# EAGLE design RS485 Ethernet Gateway v1.0 (EAGLE 9.2.1)
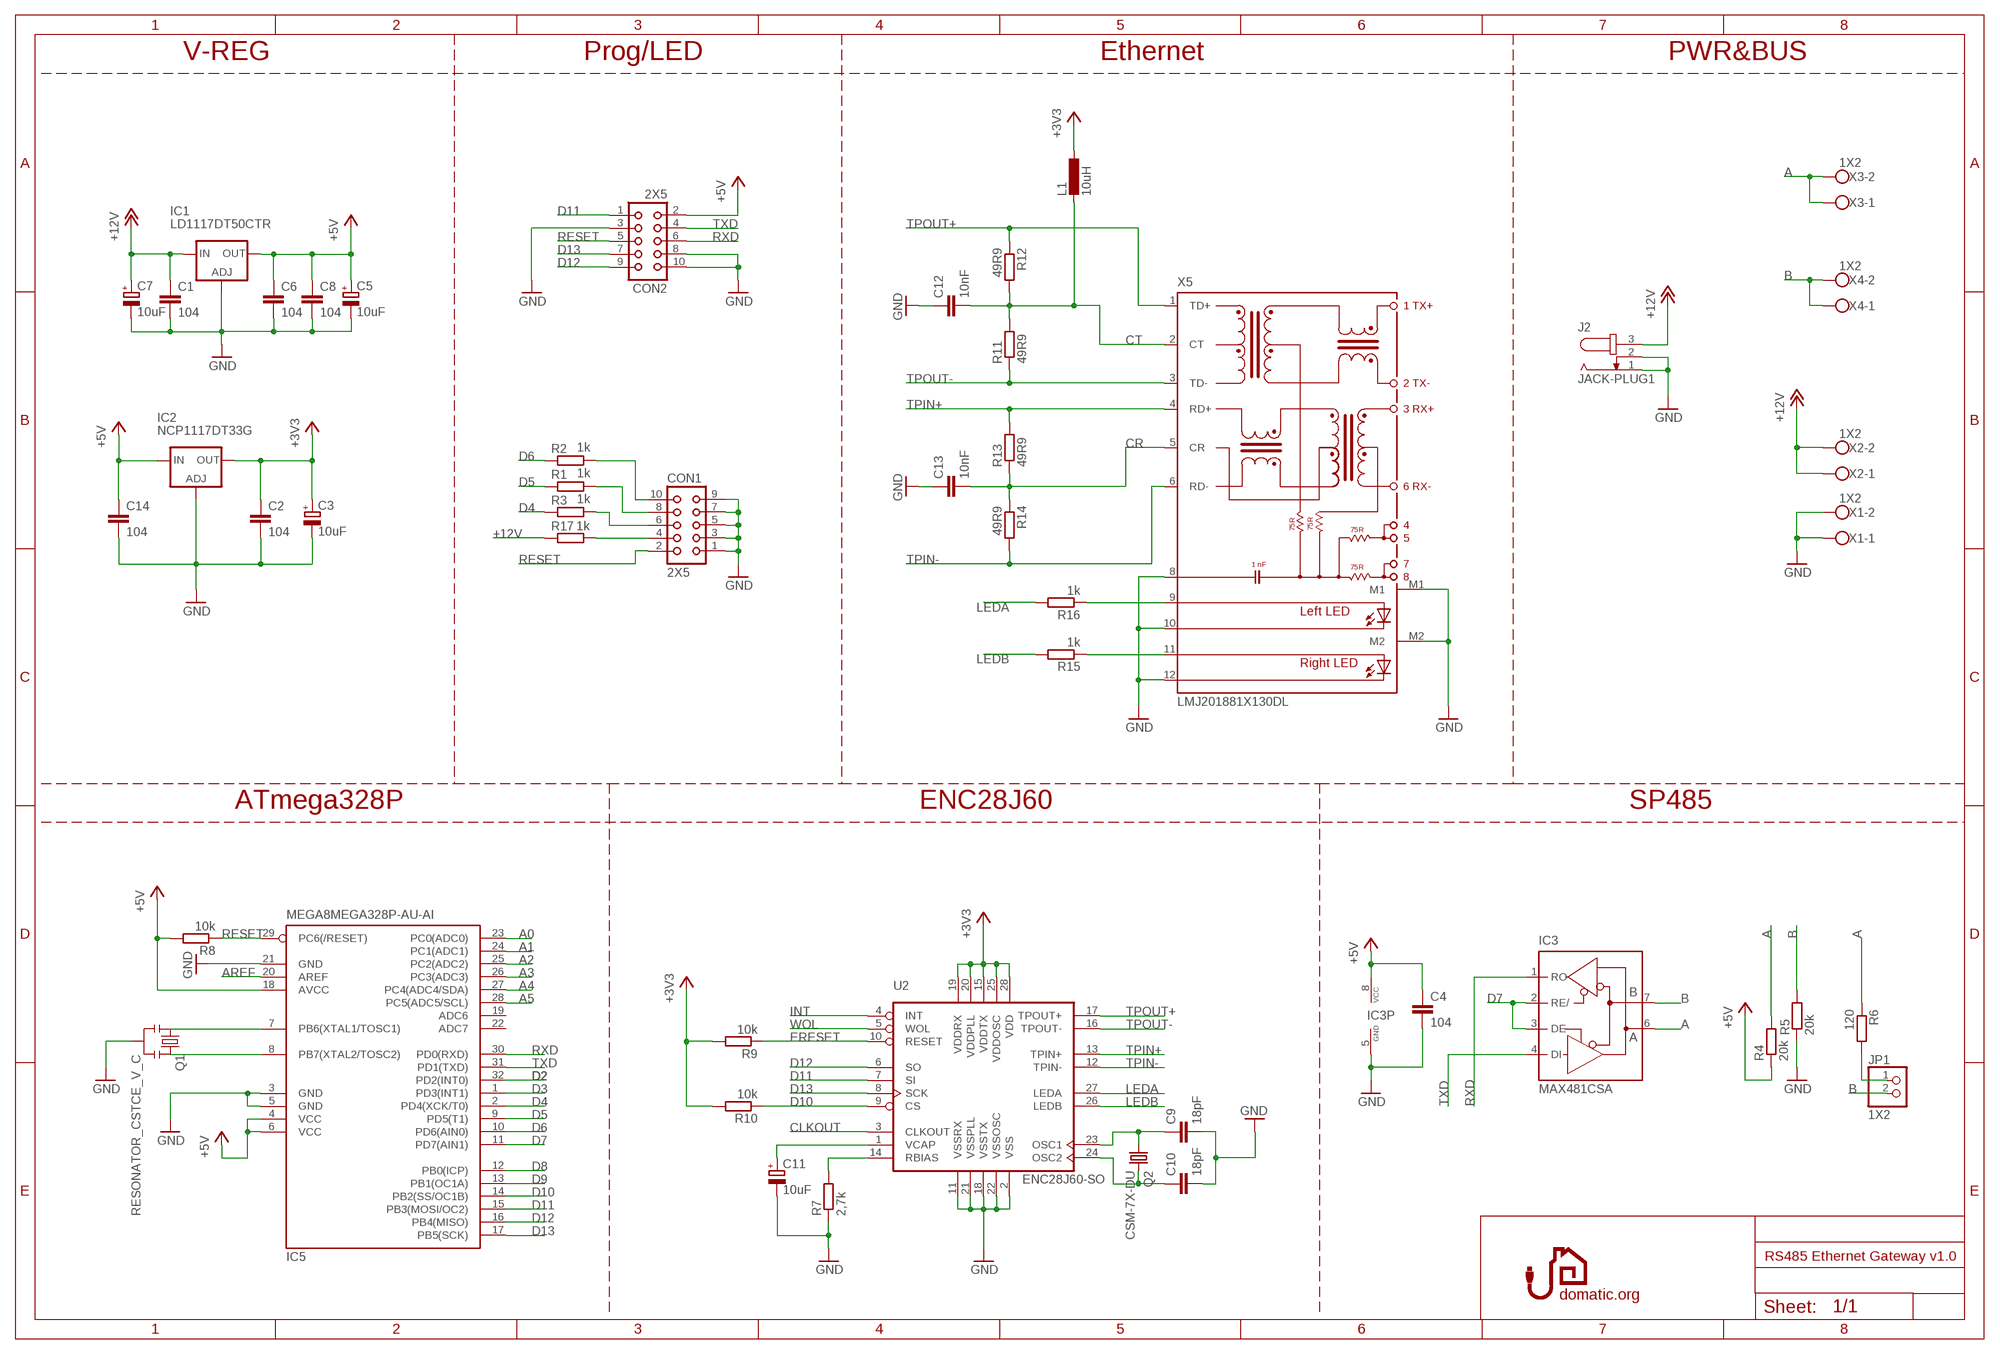
[diagram p0: schematic, sheet 1]

## Parts
C1  104  C-EUC0603  [C0603]
C2  104  C-EUC0603  [C0603]
C3  10uF  CPOL-EUE2.5-7  [E2,5-7]
C4  104  C-EUC0603  [C0603]
C5  10uF  CPOL-EUE2.5-7  [E2,5-7]
C6  104  C-EUC0603  [C0603]
C7  10uF  CPOL-EUE2.5-7  [E2,5-7]
C8  104  C-EUC0603  [C0603]
C9  18pF  C-EUC0603  [C0603]
C10  18pF  C-EUC0603  [C0603]
C11  10uF  CPOL-EUE2.5-7  [E2,5-7]
C12  10nF  C-EUC0603  [C0603]
C13  10nF  C-EUC0603  [C0603]
C14  104  C-EUC0603  [C0603]
CON1  2X5  CON10L  [CON10L]
CON2  2X5  CON10L  [CON10L]
IC1  LD1117DT50CTR  LD117ADT50TR  [DPACK]
IC2  NCP1117DT33G  LD117ADT33TR  [DPACK]
IC3  MAX481CSA  [SO08]
IC5  MEGA8MEGA328P-AU-AI  [TQFP32-08]
J2  JACK-PLUG1  [SPC4078]
JP1  1X2  PINHD-1X2  [1X02]
L1  10uH  L-EU0603  [C1608]
Q1  RESONATOR_CSTCE_V_C  [CSTCE_V_C]
Q2  CSM-7X-DU  [CSM-7X-DU]
R1  1k  R-EU_R0603  [R0603]
R2  1k  R-EU_R0603  [R0603]
R3  1k  R-EU_R0603  [R0603]
R4  20k  R-EU_R0603  [R0603]
R5  20k  R-EU_R0603  [R0603]
R6  120  R-EU_R0603  [R0603]
R7  2,7k  R-EU_R0603  [R0603]
R8  10k  R-EU_R0603  [R0603]
R9  10k  R-EU_R0603  [R0603]
R10  10k  R-EU_R0603  [R0603]
R11  49R9  R-EU_R0603  [R0603]
R12  49R9  R-EU_R0603  [R0603]
R13  49R9  R-EU_R0603  [R0603]
R14  49R9  R-EU_R0603  [R0603]
R15  1k  R-EU_R0603  [R0603]
R16  1k  R-EU_R0603  [R0603]
R17  1k  R-EU_R0603  [R0603]
U2  ENC28J60-SO  [SO28W]
X1  1X2  W237-102  [W237-102]
X2  1X2  W237-102  [W237-102]
X3  1X2  W237-102  [W237-102]
X4  1X2  W237-102  [W237-102]
X5  LMJ201881X130DL  [LMJ20188X130]

## Nets
+3V3 [zasilanie]: C2.1 C3.+ IC2.4(OUT) L1.1 R9.2 R10.2 U2.15(VDDTX) U2.19(VDDRX) U2.20(VDDPLL) U2.25(VDDOSC) U2.28(VDD)
+5V [zasilanie]: C4.1 C5.+ C6.1 C8.1 C14.1 CON2.2 IC1.4(OUT) IC2.3(IN) IC3.8(VCC) IC5.4(VCC) IC5.6(VCC) IC5.18(AVCC) R4.1 R8.2
+12V [zasilanie]: C1.1 C7.+ IC1.3(IN) J2.3 R17.2 X2.1 X2.2
A: IC3.6(A) R4.2 R6.1 X3.1 X3.2
A0: IC5.23(PC0(ADC0))
A1: IC5.24(PC1(ADC1))
A2: IC5.25(PC2(ADC2))
A3: IC5.26(PC3(ADC3))
A4: IC5.27(PC4(ADC4/SDA))
A5: IC5.28(PC5(ADC5/SCL))
AREF: IC5.20(AREF)
B: IC3.7(B) JP1.2 R5.2 X4.1 X4.2
CLKOUT: U2.3(CLKOUT)
CR: C13.2 R13.1 R14.1 X5.5(CR)
CT: C12.2 L1.2 R11.2 R12.2 X5.2(CT)
D2: IC5.32(PD2(INT0))
D3: IC5.1(PD3(INT1))
D4: IC5.2(PD4(XCK/T0)) R3.1
D5: IC5.9(PD5(T1)) R1.1
D6: IC5.10(PD6(AIN0)) R2.1
D7: IC3.2(RE/) IC3.3(DE) IC5.11(PD7(AIN1))
D8: IC5.12(PB0(ICP))
D9: IC5.13(PB1(OC1A))
D10: IC5.14(PB2(SS/OC1B)) R10.1 U2.9(CS)
D11: CON2.1 IC5.15(PB3(MOSI/OC2)) U2.7(SI)
D12: CON2.9 IC5.16(PB4(MISO)) U2.6(SO)
D13: CON2.7 IC5.17(PB5(SCK)) U2.8(SCK)
ERESET: R9.1 U2.10(RESET)
GND [zasilanie]: C1.2 C2.2 C3.- C4.2 C5.- C6.2 C7.- C8.2 C9.2 C10.2 C11.- C12.1 C13.1 C14.2 CON1.1 CON1.3 CON1.5 CON1.7 CON1.9 CON2.3 CON2.8 CON2.10 IC1.1(ADJ) IC2.1(ADJ) IC3.5(GND) IC5.3(GND) IC5.5(GND) IC5.21(GND) J2.1 J2.2 Q1.GND R5.1 R7.1 U2.2(VSS) U2.11(VSSRX) U2.18(VSSTX) U2.21(VSSPLL) U2.22(VSSOSC) X1.1 X1.2 X5.8 X5.10 X5.12 X5.M1 X5.M2
INT: U2.4(INT)
LEDA: R16.2 U2.27(LEDA)
LEDB: R15.2 U2.26(LEDB)
N$1: JP1.1 R6.2
N$2: CON1.6 R3.2
N$3: CON1.8 R1.2
N$4: C9.1 Q2.1 U2.23(OSC1)
N$5: CON1.10 R2.2
N$6: C10.1 Q2.2 U2.24(OSC2)
N$7: R7.2 U2.14(RBIAS)
N$8: C11.+ U2.1(VCAP)
N$9: CON1.4 R17.1
N$11: R16.1 X5.9
N$13: R15.1 X5.11
N$14: IC5.7(PB6(XTAL1/TOSC1)) Q1.X1
N$15: IC5.8(PB7(XTAL2/TOSC2)) Q1.X2
RESET: CON1.2 CON2.5 IC5.29(PC6(/RESET)) R8.1
RXD: CON2.6 IC3.1(RO) IC5.30(PD0(RXD))
TPIN+: R13.2 U2.13(TPIN+) X5.4(RD+)
TPIN-: R14.2 U2.12(TPIN-) X5.6(RD-)
TPOUT+ [tpout]: R12.1 U2.17(TPOUT+) X5.1(TD+)
TPOUT- [tpout]: R11.1 U2.16(TPOUT-) X5.3(TD-)
TXD: CON2.4 IC3.4(DI) IC5.31(PD1(TXD))
WOL: U2.5(WOL)
Unconnected: IC5.19(ADC6) IC5.22(ADC7)

## Notes on the sheet
- V-REG | Prog/LED | Ethernet | PWR&BUS
- ATmega328P | ENC28J60 | SP485

## Library data of the parts
C1 C2 C4 C6 C8-C10 C12-C14 = resistor:C-EU: CAPACITOR, European symbol
C3 C5 C7 C11 = moje resistor:CPOL-EU: POLARIZED CAPACITOR, European symbol
CON1 CON2 = con-harting:CON10L: CONNECTOR; OC_FARNELL: unknown; OC_NEWARK: unknown
IC1 IC2 = v-reg:LD117A?*: Low drop fixed and adjustable positive voltage regulators 1 A Source: http://www.st.com/stonline/products/literature/ds/7194/ld1117axx.pdf
IC3 = maxim:MAX481CSA: RS485 TRANSEIVER; MF: MAXIM; MPN: MAX481CSA; OC_FARNELL: unknown; OC_NEWARK: 90C3817
IC5 = atmel_2:MEGA8: MICROCONTROLLER 8 Kbytes FLASH, 1 kbytes SRAM, 512 bytes EEPROM, USART, 6-channel 10 bit ADC, 2-channel 8 bit ADC Pin compatible with Atmega48, ATMega88, ATMega168 Source: avr.lbr; MPN: ATMEGA328P-AU
J2 = con-jack:JACK-PLUG: DC POWER JACK Power Jack, DC, Right Angle, Through Hole, Rated 5A at 16VDC, PC Terminals Distributor: Farnell (www.Farnell.de) Drawing: 84N1161.pdf / 84N1162.pdf Manufacturer: SPC Technology (www.spctechnology.com) Type: SPC4077 / SPC 4078; OC_FARNELL: unknown; OC_NEWARK: unknown
JP1 = pinhead:PINHD-1X2: PIN HEADER
L1 = resistor:L-EU: INDUCTOR, European symbol
Q1 = bt_crystal:RESONATOR: Crystal Resonator, 3-pin
Q2 = crystal:CSM-7X-DU: SMD CRYSTAL Source: www.ecsxtal.com .. Crystal 3.6864MHz CSM_7X_DU.PDF; OC_FARNELL: unknown; OC_NEWARK: unknown
R1-R17 = resistor:R-EU_: RESISTOR, European symbol
U2 = microchip-enc28j60:ENC28J60-*: Microchip 10Mbit Eth. contoller with SPI interface
X1-X4 = con-wago-500:W237-102: WAGO SCREW CLAMP; MPN: 237-102; OC_FARNELL: unknown; OC_NEWARK: 70K9898
X5 = con-pulse:LMJ201881X130DL: PULSEJACK (TM) 1x1 Tab-UP RJ45 10/100 Base-TX RJ45 1x1 Tab-UP with LEDs 8-pin (J1 series) and 6-pin (JP series) integrated magnetics connector, designed to support applications, such as ADSL modems, LAN-on-Motherboard, and Hub and Switches. Source: www.pulseeng.com .. PulseJack-J402.pdf

## Net classes
0 default: width 0.305 mm, drill 0.8 mm, clearance 0.3 mm
1 zasilanie: width 0.305 mm, drill 0.8 mm, clearance 0.3 mm
2 rszasilanie: width 2.54 mm, drill 1 mm, clearance 0.3 mm
3 tpout: width 0.305 mm, drill 0.8 mm, clearance 0.3 mm

## Board
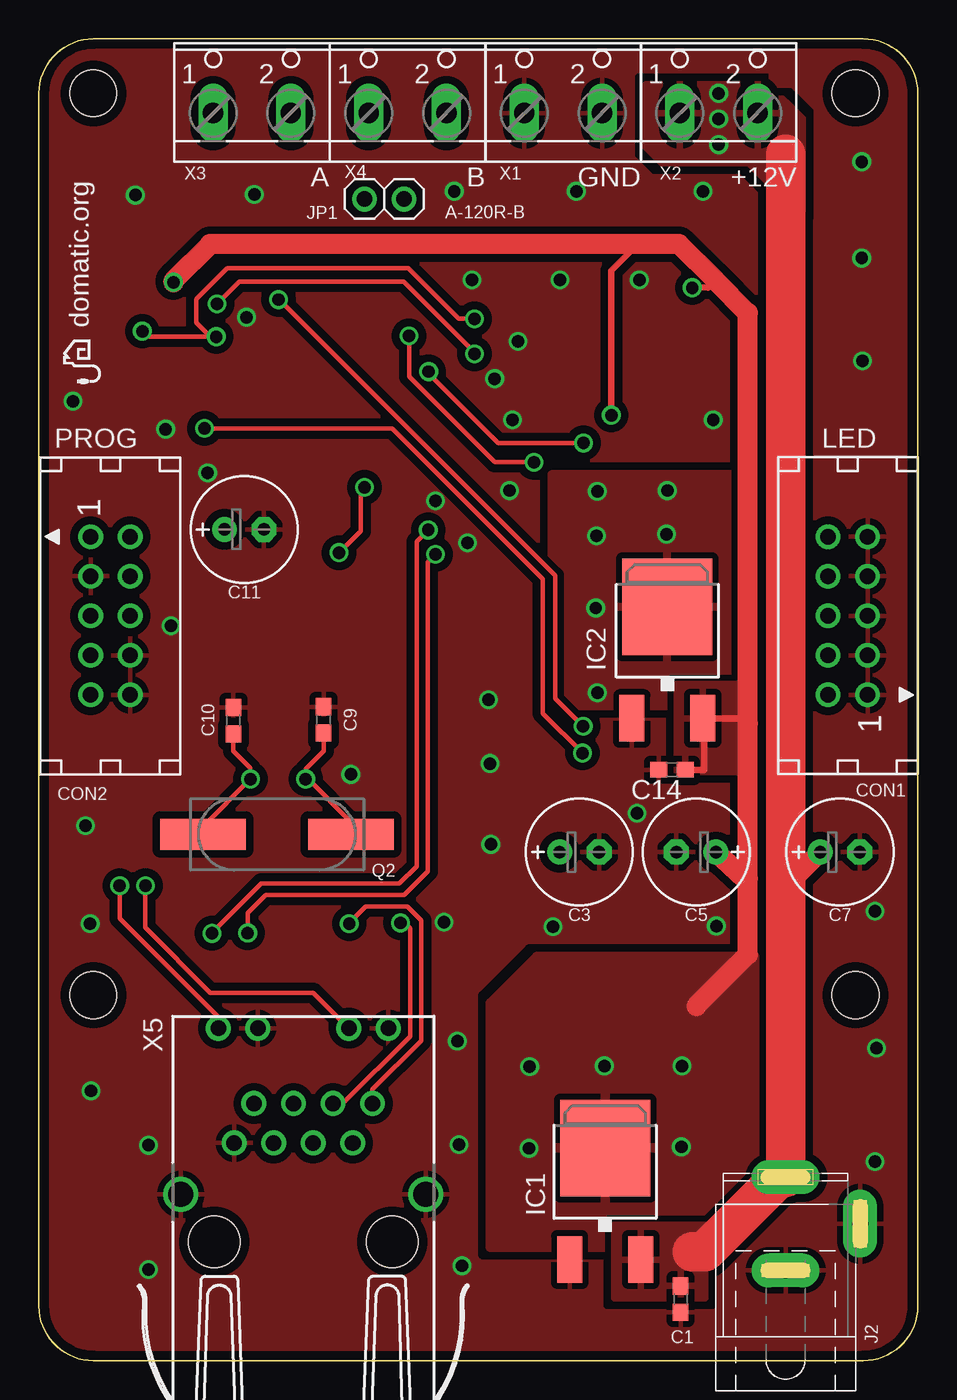
[diagram p1: board, top side]
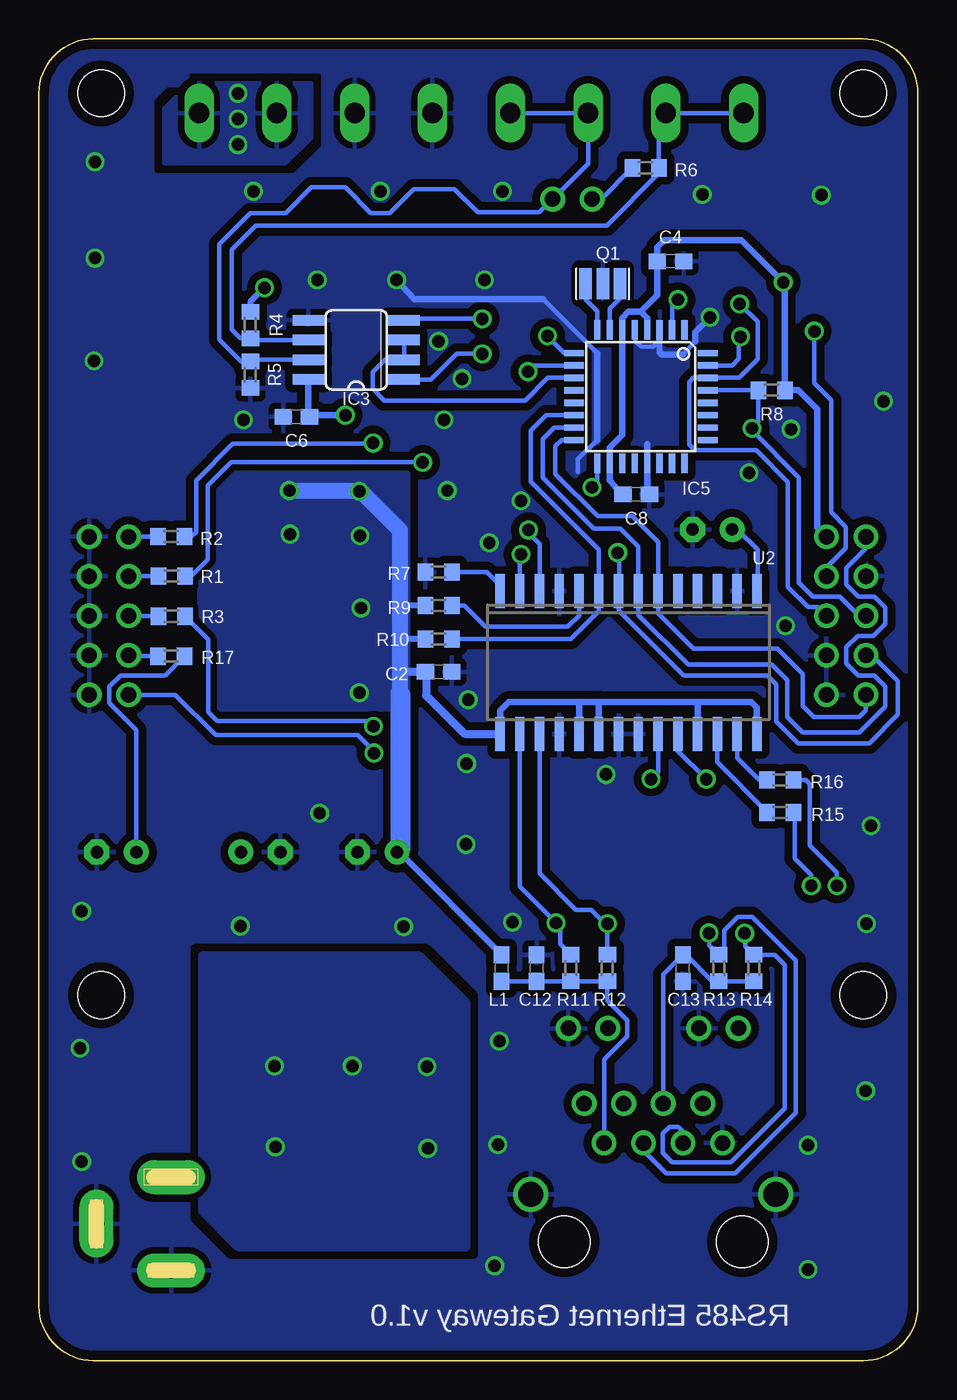
[diagram p2: board, bottom side, seen from below]

Size 56.5 x 85 mm. Coordinates in mm from the lower left corner, seen from the top.
Outline: 53,85 3.5,85 arc90 0,81.5 0,3.5 arc90 3.5,0 53,0 arc90 56.5,3.5 56.5,81.5 arc90 53,85
Copper layers (1*16): Top 0.035mm / dielectric 1.5mm / Bottom 0.035mm
Design rules "default *": minimum track width 0.3mm, minimum drill 0.8mm, track to track 0.39mm, track to pad 0.3mm, pad to pad 0.3mm, via to via 0.4mm, smd to smd 0.25mm, copper to edge 0.6mm, drill to drill 0.3mm, minimum pad ring 0.3mm, minimum via ring 8mil, stop-mask expansion 4mil, vias tented up to drill 0mil, thermal gap 0.4mm
Holes 3 mm at 3.5,81.5 52.5,81.5 3.5,23.5 52.5,23.5

### Footprints (pad centres in the part's own frame; a part is rotated, then mirrored left to right if it is on the bottom)
C0603 = smd 1.1 x 1: 1 -0.85,0; 2 0.85,0
E2,5-7 = drill 0.8 pad 1.6: + -1.27,0 | drill 0.8 pad 1.6 octagon: - 1.27,0
CON10L = drill 1: 1 5.08,1.27; 2 5.08,-1.27; 3 2.54,1.27; 4 2.54,-1.27; 5 0,1.27; 6 0,-1.27; 7 -2.54,1.27; 8 -2.54,-1.27; 9 -5.08,1.27; 10 -5.08,-1.27
DPACK = smd 1.6 x 3: 1 -2.28,-4.8; 3 2.28,-4.8 | smd 5.8 x 6.2: 4 0,2.38
SO08 = smd 0.66 x 2.032: 1 -1.905,-3.073; 2 -0.635,-3.073; 3 0.635,-3.073; 4 1.905,-3.073; 5 1.905,3.073; 6 0.635,3.073; 7 -0.635,3.073; 8 -1.905,3.073
TQFP32-08 = smd 1.27 x 0.4: 1 -4.293,2.8; 2 -4.293,2; 3 -4.293,1.2; 4 -4.293,0.4; 5 -4.293,-0.4; 6 -4.293,-1.2; 7 -4.293,-2; 8 -4.293,-2.8; 17 4.293,-2.8; 18 4.293,-2; 19 4.293,-1.2; 20 4.293,-0.4; 21 4.293,0.4; 22 4.293,1.2; 23 4.293,2; 24 4.293,2.8 | smd 0.4 x 1.27: 9 -2.8,-4.293; 10 -2,-4.293; 11 -1.2,-4.293; 12 -0.4,-4.293; 13 0.4,-4.293; 14 1.2,-4.293; 15 2,-4.293; 16 2.8,-4.293; 25 2.8,4.293; 26 2,4.293; 27 1.2,4.293; 28 0.4,4.293; 29 -0.4,4.293; 30 -1.2,4.293; 31 -2,4.293; 32 -2.8,4.293
SPC4078 = drill 1 pad 2.184 long: 1 -3,0; 2 0,-4.8; 3 3,0
1X02 = drill 1: 1 -1.27,0; 2 1.27,0
C1608 = smd 1.1 x 1: 1 -0.85,0; 2 0.85,0
CSTCE_V_C = smd 0.8 x 2: GND 0,0; X1 -1.1,0; X2 1.1,0
CSM-7X-DU = smd 5.5 x 2: 1 -4.75,0; 2 4.75,0
R0603 = smd 1 x 1.1: 1 -0.85,0; 2 0.85,0
SO28W = smd 0.6 x 2.2: 1 -8.255,-4.6; 2 -6.985,-4.6; 3 -5.715,-4.6; 4 -4.445,-4.6; 5 -3.175,-4.6; 6 -1.905,-4.6; 7 -0.635,-4.6; 8 0.635,-4.6; 9 1.905,-4.6; 10 3.175,-4.6; 11 4.445,-4.6; 12 5.715,-4.6; 13 6.985,-4.6; 14 8.255,-4.6; 15 8.255,4.6; 16 6.985,4.6; 17 5.715,4.6; 18 4.445,4.6; 19 3.175,4.6; 20 1.905,4.6; 21 0.635,4.6; 22 -0.635,4.6; 23 -1.905,4.6; 24 -3.175,4.6; 25 -4.445,4.6; 26 -5.715,4.6; 27 -6.985,4.6; 28 -8.255,4.6
W237-102 = drill 1.3 long: 1 -2.5,-1.27; 2 2.5,-1.27
LMJ20188X130 = drill 1 pad 1.5: 1 4.445,2.54; 2 3.175,0; 3 1.905,2.54; 4 0.635,0; 5 -0.635,2.54; 6 -1.905,0; 7 -3.175,2.54; 8 -4.445,0 | drill 1 pad 1.422: 9 -5.465,7.37; 10 -2.925,7.37; 11 2.925,7.37; 12 5.465,7.37 | drill 1.6 pad 2.184: M1 -7.875,-3.3; M2 7.875,-3.3 | hole 3.3: 5.715,-6.35; -5.715,-6.35

### Placement (x,y rotation side)
C1  41.25,3.95 270 top
C2  30.8,44.3 0 bottom
C3  34.75,32.7 0 top
C4  15.9,70.7 0 bottom
C5  42.25,32.7 180 top
C6  39.95,60.7 180 bottom
C7  51.5,32.7 0 top
C8  18.1,55.7 0 bottom
C9  18.3,41.2 90 top
C10  12.5,41.15 90 top
C11  13.2,53.45 0 top
C12  24.5,25.25 270 bottom
C13  15.1,25.25 90 bottom
C14  40.7,38 180 top
CON1  52,47.9 270 top
CON2  4.6,47.9 90 top
IC1  36.4,11.3 0 top
IC2  40.4,46.1 0 top
IC3  36.1,65 90 bottom
IC5  17.8,62 270 bottom
J2  48,8.8 90 top
JP1  22.2,74.7 0 top
L1  26.75,25.25 270 bottom
Q1  20.25,69.25 180 bottom
Q2  15.3,33.85 180 top
R1  47.97,50.45 180 bottom
R2  48,53 180 bottom
R3  47.97,47.87 180 bottom
R4  42.9,66.6 270 bottom
R5  42.9,63.4 90 bottom
R6  17.5,76.7 180 bottom
R7  30.8,50.7 0 bottom
R8  9.4,62.4 0 bottom
R9  30.8,48.55 180 bottom
R10  30.8,46.4 180 bottom
R11  22.3,25.25 270 bottom
R12  19.95,25.25 270 bottom
R13  12.8,25.25 90 bottom
R14  10.55,25.25 90 bottom
R15  8.85,35.25 180 bottom
R16  8.85,37.35 180 bottom
R17  48,45.3 0 bottom
U2  18.6,44.9 180 bottom
U$3  [LOGO2.5MMBEZNAZWY]  4,62.8 90 top
X1  33.7,81.5 0 top
X2  43.7,81.5 0 top
X3  13.7,81.5 0 top
X4  23.7,81.5 0 top
X5  17,14 0 top

### Tracks (layer width: path | path; a pad name or v marks a point on that pad's centre or on a via)
+3V3  (via drill 0.8)
  Bottom 0.4: R9.2 32.84,48.55 33.29,49 | R10.2 32.89,46.4 33.29,46 | 32.99,44.3 33.29,44
  Bottom 0.406: U2.20 20.5,42.2 20.35,42.35 | 20.35,42.35 14.16,42.35 | 14.16,42.35 U2.25 | 14.16,42.35 10.7,42.35 10.35,41.99 U2.28 | 21.77,42.35 26.3,42.35 26.86,41.8 U2.15 | U2.19 21.77,42.35 | 20.35,42.35 21.77,42.35 | L1.1 33.35,32.7 C3.+ 33.24,32.94
  Bottom 0.508: U2.15 29.14,40.3 31.6,42.77 31.6,44.25 C2.1 32.99,44.3
  Bottom 1.016: v40.4,55.95 35.84,55.95 33.29,53.4 33.29,49 33.29,46 33.29,44 33.29,42.84 | 33.24,42.79 33.29,42.84 | 33.29,42.84 33.39,42.94
  Bottom 1.27: 33.24,32.94 33.24,42.79
  other vias: 40.35,53.15 35.8,48.4 35.9,42.95 35.85,53.05 35.9,55.9
  pour Top (isolate 0.1, rank 2): 32.95,42.1 45,42.1 45,57 32.95,57
  pour Bottom (isolate 0.1): 32.85,57 44.45,57 46.1,55.35 46.1,42 32.85,42
+5V  (via drill 0.8)
  Top 0.4: 43.47,69.47 43,69 v42,69
  Top 0.406: v36.8,60.8 36.8,70.1 38.5,71.8 | 45.58,41 45.28,41.3 IC2.3 42.78,41.2 42.78,38 C14.1
  Top 1.27: 42.27,22.8 45.58,26.11 45.58,31 | 45.58,31 45.58,41 45.58,67.36 43.47,69.47 41.14,71.8 38.5,71.8 11,71.8 8.65,69.45 v8.65,69.35 | C5.+ 45.34,31 45.58,31
  Bottom 0.305: 39.17,60.77 C6.1 39,60.8
  Bottom 0.4: v42,69 42.9,68.1 R4.1
  Bottom 0.406: R8.2 8.6,62.45 | R8.2 7.7,62.4 6.47,61.18 6.47,53.58 CON2.2 | C8.1 19.43,56.18 19.43,56.22 19.8,56.59 IC5.18 19.8,58.71 18.99,59.51 IC5.6 19,67.05 18.6,67.45 17.81,67.45 | 39.17,60.77 IC3.8 | v36.8,60.8 39,60.8 | IC5.4 17.4,67.04 17.81,67.45 | R8.2 8.55,69.25 v8.65,69.35 11.35,72.05 16.3,72.05 16.75,71.6 C4.1 16.75,68.51 17.81,67.45
  other vias: 36.35,18.95 31.5,13.65 41.3,13.75 41.35,18.95 31.55,18.9
  pour Top (rank 2): 29,7.3 41.3,7.3 46.03,12.03 46.03,26 32,26 29,23
  pour Bottom: 29,7.3 29,23 32.05,26.05 46.03,26.05 46.03,9.63 43.7,7.3
  pour Top: 41,43.5 41,37.85 46,37.85 46,43.5
+12V  (via drill 0.8)
  Top 0.305: 47.7,77.6 48,77.6
  Top 1.27: C7.+ 48.53,31 48,31
  Top 2.54: 48,77.6 48,31 J2.3 47.6,11.8 42.8,7 42,7
  Bottom 0.305: C7.+ 50.23,40.55 51.98,42.3 51.98,43.34 51.25,44.07 48.38,44.07 R17.2
  other vias: 43.7,78.2 43.7,81.5 43.7,79.85
  pour Top: 42.85,8.75 42.85,4 37,4 37,8.75
  pour Bottom: 40.65,77 39,78.65 39,82.15 46.8,82.15 48.45,80.5 48.45,77
  pour Top: 46.95,73.95 46.95,75.65 45.6,77 40,77 39,78 39,82.1 46.9,82.1 49.1,79.9 49.1,73.95
A
  Bottom 0.305: IC3.6 42.78,65.64 | R4.2 43.55,65.75 44.1,66.3 44.1,71.45 42.55,73 20,73 16.65,76.35 R6.1 16.65,79.78 X3.2 X3.1
  Bottom 0.4: 42.78,65.64 R4.2
B
  Bottom 0.305: IC3.7 42.78,64.36 R5.2 43.5,64.25 44.91,65.66 44.91,71.8 42.9,73.81 40.65,73.81 39,75.45 36.8,75.45 35.16,73.81 33.95,73.81 32.41,75.35 29.8,75.35 28.3,73.85 24.32,73.85 JP1.2 21.2,76.97 X4.1 X4.2
CR
  Bottom 0.305: R14.1 R13.1 13.2,24.4 14.9,26.1 C13.2 16.36,24.84 X5.5
CT
  Bottom 0.305: L1.2 C12.2 R11.2 R12.2 19.95,23.17 18.67,21.89 18.67,20.85 20.16,19.37 20.16,14.02 X5.2
D4  (via drill 0.8)
  Top 0.305: v15.41,68.23 15.46,68.23 33.2,50.49 33.2,42.58 v34.99,40.79
  Bottom 0.305: IC5.2 15.8,67.84 v15.41,68.23 | R3.1 45.62,46.37 45.62,41.72 45.02,41.12 35.32,41.12 v34.99,40.79
D5  (via drill 0.8)
  Top 0.305: v23.8,65.9 23.8,63.29 29.32,57.77 v31.83,57.77
  Bottom 0.305: IC5.9 22.74,64.8 23.8,65.86 v23.8,65.9 | 31.85,57.75 v31.83,57.77 44.14,57.77 45.65,56.26 45.65,51.52 46.72,50.45 R1.1
D6  (via drill 0.8)
  Top 0.305: v25.06,63.6 25.06,63.48 29.52,59.01 v35.01,59.01
  Bottom 0.305: IC5.10 24.66,64 v25.06,63.6 | v35.01,59.01 35.06,58.96 44.04,58.96 46.4,56.6 46.4,53.3 46.7,53 R2.1
D7
  Bottom 0.305: IC3.3 IC3.2 34.24,64.36 35.05,63.56 35.05,62.5 34.3,61.75 25.25,61.75 23.8,63.2 IC5.11
D10
  Bottom 0.305: IC5.14 23.9,60.8 24.89,59.8 24.89,56.55 20.5,52.16 U2.9 20.5,48.2 22.3,46.4 R10.1
D11
  Bottom 0.305: IC5.15 23.37,60 24.09,59.27 24.09,56.78 20.83,53.52 19.12,53.52 17.96,52.37 U2.7 17.96,47.96 14.77,44.77 9.38,44.77 8.39,43.77 8.39,41.38 7.41,40.41 3.75,40.41 2.08,42.08 2.08,43.34 2.81,44.07 3.81,44.07 4.58,44.84 4.58,45.88 3.85,46.61 2.85,46.61 2.08,47.38 2.08,48.42 2.81,49.15 3.81,49.15 4.58,49.92 4.58,50.96 3.33,52.21 CON2.1
D12
  Bottom 0.305: IC5.16 22.89,59.2 23.29,58.8 23.29,57.02 20.59,54.32 18.37,54.32 16.7,52.65 U2.6 16.7,48.05 14.45,45.8 9.05,45.8 7.4,44.15 7.4,42.1 6.7,41.4 3.75,41.4 3.33,41.82 CON2.9
D13  (via drill 0.8)
  Top 0.305: v20.94,56.16 20.69,55.91 20.69,53.35 v19.3,51.96
  Bottom 0.305: CON2.7 2.93,45.36 1.28,43.71 1.28,41.55 3.13,39.7 7.7,39.7 9.09,41.09 9.09,43.48 9.68,44.06 15.06,44.06 19.23,48.23 U2.8 19.2,49.5 19.2,51.86 v19.3,51.96 | IC5.17 20.6,56.5 v20.94,56.16
ERESET
  Bottom 0.305: R9.1 29.15,48.55 27.8,47.2 22.5,47.2 21.77,47.92 U2.10
GND  (via drill 0.8)
  Bottom 0.305: 20.61,59.21 21.85,57.97 21.85,57.15 | 24.07,68.26 20.61,64.79 | 14.3,65.52 15.12,64.7 | IC5.5 18.15,66.25 18.15,65.57 17.79,65.2 17.01,65.2 16.6,65.62 16.6,66
  Bottom 0.4: 16.6,64.85 16.6,66 IC5.3
  Bottom 0.406: C8.2 17.4,55.85 IC5.21 17.4,58.95 | 20.61,64.79 20.61,59.21 | v33.5,69.5 32.36,68.26 24.07,68.26 | v13.35,67.1 14.3,66.15 14.3,65.52 | 15.12,64.7 16.45,64.7 16.6,64.85
  other vias: 29.3,63.15 10.85,57.1 25.5,55.3 29,38.4 3,34.4 3.3,28.1 33.05,27.9 43.55,27.95 53.85,20.1 52.9,77.1 26.7,75.2 2.2,61.7 38.6,69.5 53.75,28.9 28.9,42.5 53.75,12.8 27.2,6.1 27,13.9 29.05,33.2 20.05,37.7 8.5,47.25 34.55,75.2 42.7,75.2 6.2,74.95 13.85,75 52.9,70.9 52.95,64.3 30.45,60.5 43.35,60.5 3.35,17.35 8.15,59.9 26.9,20.55 30.25,55.95 27.55,52.6 27.85,69.5 26.05,28.2 7.05,13.85 7.05,5.85 38.45,35.2 30.8,65.55
  pour Bottom (isolate 0.5, rank 3): 0,0 56.5,0 56.5,85 0,85
  pour Top (isolate 0.5, rank 3): 0,0 56.5,0 56.5,85 0,85
LEDA
  Bottom 0.305: U2.27 11.62,38.77 10.2,37.35 R16.2
LEDB
  Bottom 0.305: R15.2 9.7,35.3 12.88,38.48 U2.26
N$1
  Bottom 0.305: R6.2 20.35,74.7 JP1.1
N$2
  Bottom 0.305: CON1.6 50.7,47.87 R3.2
N$3
  Bottom 0.305: CON1.8 R1.2
N$4  (via drill 0.8)
  Top 0.305: Q2.1 20.05,34.65 17.3,37.4 v17.15,37.4 17.15,38.05 18.3,39.2 C9.1
  Bottom 0.305: v17.15,37.4 16.7,37.85 U2.23
N$5
  Bottom 0.305: CON1.10 48.87,52.98 R2.2
N$6  (via drill 0.8)
  Top 0.305: Q2.2 10.55,34.35 v13.6,37.4 13.6,38.1 12.5,39.2 C10.1
  Bottom 0.305: U2.24 15.45,40.27 15.45,39.25 v13.6,37.4
N$7
  Bottom 0.305: R7.2 27.7,50.7 26.86,49.85 U2.14
N$8
  Bottom 0.305: C11.+ 11.6,53.45 10.29,52.15 10.29,49.55 U2.1
N$9
  Bottom 0.305: CON1.4 50.67,45.3 R17.1
N$11  (via drill 0.8)
  Top 0.305: v5.19,30.55 5.19,28.43 11.54,22.09 X5.9
  Bottom 0.305: R16.1 7.21,37.35 6.93,37.07 6.93,33.14 5.19,31.4 v5.19,30.55
N$13  (via drill 0.8)
  Top 0.305: X5.11 17.64,23.65 11.02,23.65 6.83,27.84 6.83,30.53 v6.85,30.55
  Bottom 0.305: R15.1 7.9,35.15 7.9,32.3 6.85,31.25 v6.85,30.55
N$14
  Bottom 0.305: IC5.7 19.81,67.64 19.15,68.3 Q1.X1
N$15
  Bottom 0.305: 20.6,66.54 IC5.8 20.6,67.49 21.35,68.24 Q1.X2
RESET  (via drill 0.8)
  Top 0.305: v10.65,59.95 22.72,59.95 32.4,50.27 32.4,41.62 v34.95,39.07
  Bottom 0.305: v34.95,39.07 34.95,39.17 36,40.22 45.13,40.22 47.73,42.82 CON1.2 | IC5.29 R8.1 10.25,60.35 v10.65,59.95 10.65,59.8 7.64,56.79 7.64,50.05 6.75,49.15 5,49.15 3.75,47.9 CON2.5
RXD  (via drill 0.8)
  Top 0.305: v11.45,67.96 12.88,69.39 23.46,69.39 28,64.85 v28,64.75
  Bottom 0.305: IC3.1 33.01,63.08 31.32,63.08 29.65,64.75 v28,64.75 | v11.45,67.96 10.29,66.8 10.29,64.39 11.48,63.2 IC5.30 14.43,63.2 14.7,62.94 14.7,58.91 14.33,58.55 10.4,58.55 8.35,56.5 8.35,49.75 7.04,48.45 6.42,48.45 CON2.6
TPIN+  (via drill 0.8)
  Top 0.305: v13.42,27.5 13.42,28.8 14.57,29.95 23.49,29.95 25,31.46 25,51.35 v25.5,51.85
  Bottom 0.305: U2.13 25.59,51.77 v25.5,51.85 | 12.97,26.27 R13.2 | X5.4 17.64,13.52 16.16,12.04 11.74,12.04 7.84,15.94 7.84,25.74 10.64,28.54 11.57,28.54 12.44,27.67 12.44,26.46 R13.2 | v13.42,27.5 13.4,27.48 13.4,26.7 R13.2
TPIN-  (via drill 0.8)
  Top 0.305: v11.13,27.48 11.13,27.53 14.28,30.68 23.18,30.68 24.29,31.79 24.29,52.68 v25.03,53.42
  Bottom 0.305: v25.03,53.42 25.03,53.22 24.32,52.51 U2.12 | R14.2 10.38,26.27 | v11.13,27.48 11.1,27.45 11.1,26.65 R14.2 | R14.2 9.2,26.1 8.55,25.45 | 8.55,25.45 | 8.55,25.45 8.55,16.95 8.55,16.24 12.04,12.75 15.78,12.75 16.38,13.35 16.38,14.62 15.95,15.05 15.4,15.05 15.09,14.74 X5.6
TPOUT+  (via drill 0.8)
  Top 0.305: v19.95,28.1 19.95,28.15 21.01,29.21 23.69,29.21 24.57,28.32 24.57,20.57 21.45,17.45 X5.1
  Bottom 0.305: R12.1 v19.95,28.1 20.1,28.1 21,29 22,29 24.32,31.32 U2.17
TPOUT-  (via drill 0.8)
  Top 0.305: v23.25,28.15 23.5,28.15 23.87,27.78 23.87,20.87 19.54,16.54 X5.3
  Bottom 0.305: 25.54,40.25 U2.16 25.59,30.48 v23.25,28.15 23,27.9 23,26.8 R11.1
TXD  (via drill 0.8)
  Top 0.305: v6.65,66.2 7,65.85 v11.4,65.85 11,65.85 10.1,66.75 10.1,68.25 12.1,70.25 23.75,70.25 27,67 v28,67
  Bottom 0.305: IC5.31 11.94,64 11.5,64.44 11.5,65.75 v11.4,65.85 | v6.65,66.2 6.65,62.85 5.57,61.77 5.57,54.57 4.62,53.62 4.62,52.26 5.87,51.01 CON2.4 | IC3.4 32.93,67 v28,67

### Text on the board
tNames: A | B | GND | +12V | A-120R-B | domatic.org | PROG | LED
bNames: RS485 Ethernet Gateway v1.0